# Altium schematic sheet Cell_Connections.SchDoc
size Letter
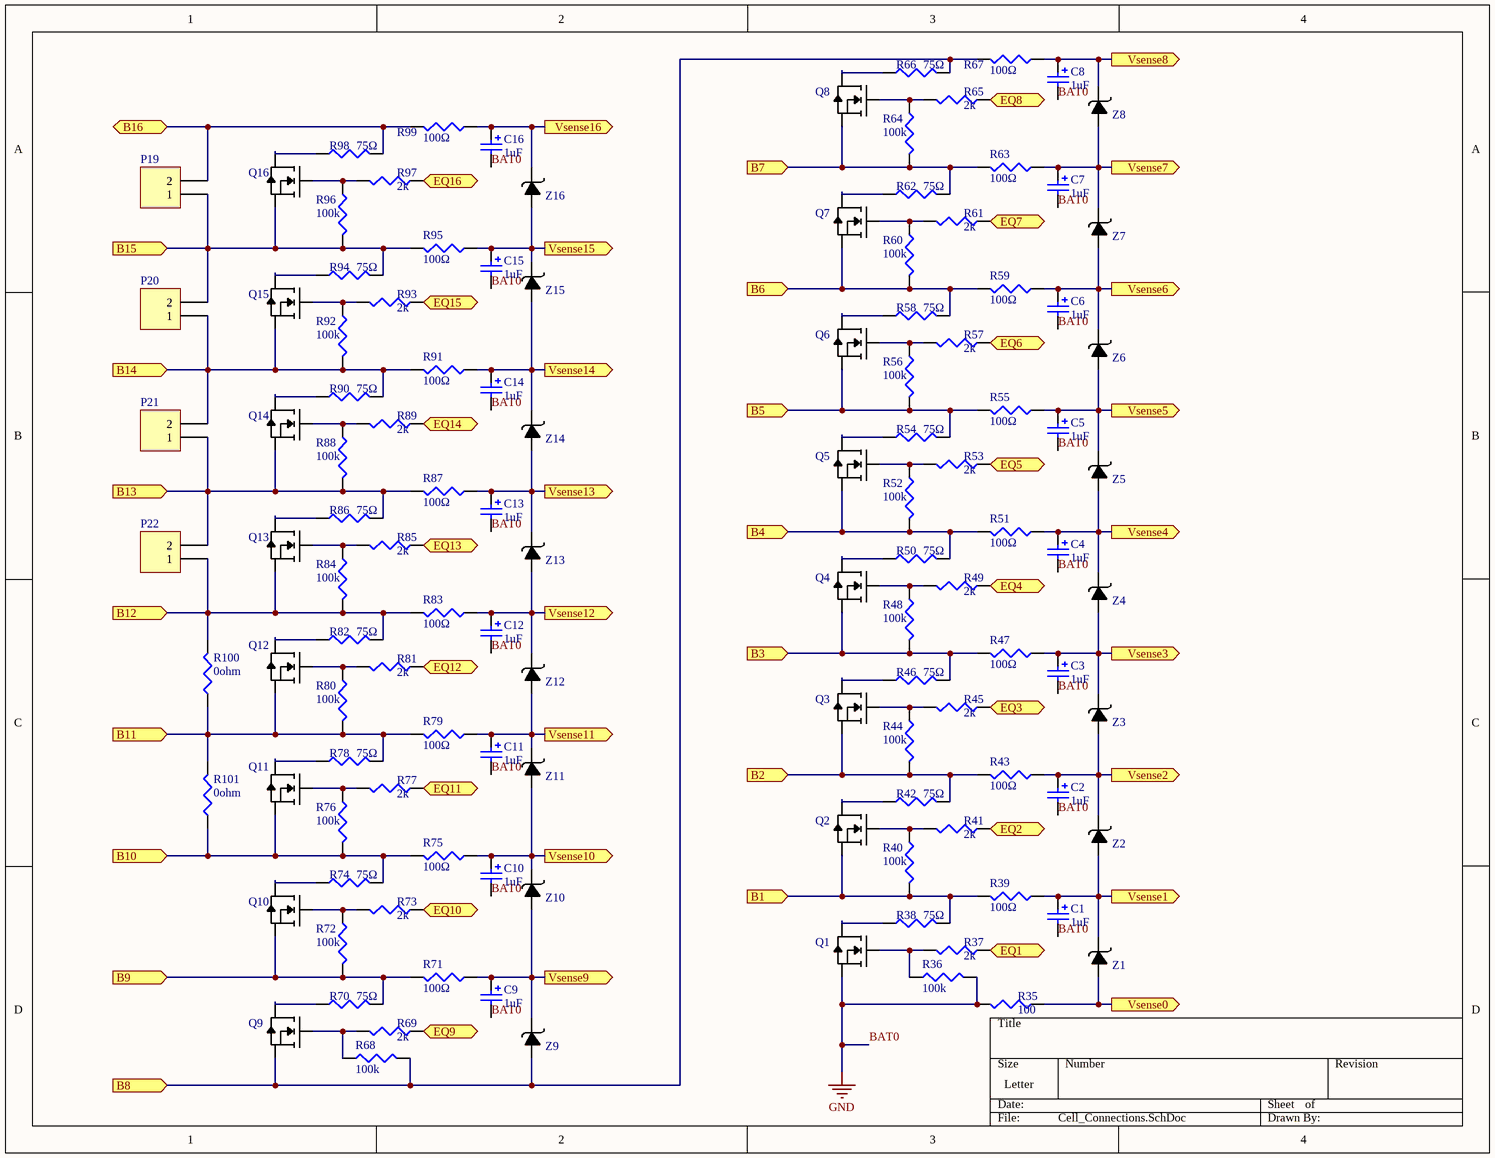
[diagram p0: Cell_Connections.SchDoc]

## Parts
C1  value 1uF  [SMD1206 Polarized]  (hidden comment: Cap)
C2  value 1uF  [SMD1206 Polarized]  (hidden comment: Cap)
C3  value 1uF  [SMD1206 Polarized]  (hidden comment: Cap)
C4  value 1uF  [SMD1206 Polarized]  (hidden comment: Cap)
C5  value 1uF  [SMD1206 Polarized]  (hidden comment: Cap)
C6  value 1uF  [SMD1206 Polarized]  (hidden comment: Cap)
C7  value 1uF  [SMD1206 Polarized]  (hidden comment: Cap)
C8  value 1uF  [SMD1206 Polarized]  (hidden comment: Cap)
C9  value 1uF  [SMD1206 Polarized]  (hidden comment: Cap)
C10  value 1uF  [SMD1206 Polarized]  (hidden comment: Cap)
C11  value 1uF  [SMD1206 Polarized]  (hidden comment: Cap)
C12  value 1uF  [SMD1206 Polarized]  (hidden comment: Cap)
C13  value 1uF  [SMD1206 Polarized]  (hidden comment: Cap)
C14  value 1uF  [SMD1206 Polarized]  (hidden comment: Cap)
C15  value 1uF  [SMD1206 Polarized]  (hidden comment: Cap)
C16  value 1uF  [SMD1206 Polarized]  (hidden comment: Cap)
P19  Header  [Header 2x1]  (value not drawn)
P20  Header  [Header 2x1]  (value not drawn)
P21  Header  [Header 2x1]  (value not drawn)
P22  Header  [Header 2x1]  (value not drawn)
Q1  Transistor  [Transistor 3-Lead]  (value not drawn)
Q2  Transistor  [Transistor 3-Lead]  (value not drawn)
Q3  Transistor  [Transistor 3-Lead]  (value not drawn)
Q4  Transistor  [Transistor 3-Lead]  (value not drawn)
Q5  Transistor  [Transistor 3-Lead]  (value not drawn)
Q6  Transistor  [Transistor 3-Lead]  (value not drawn)
Q7  Transistor  [Transistor 3-Lead]  (value not drawn)
Q8  Transistor  [Transistor 3-Lead]  (value not drawn)
Q9  Transistor  [Transistor 3-Lead]  (value not drawn)
Q10  Transistor  [Transistor 3-Lead]  (value not drawn)
Q11  Transistor  [Transistor 3-Lead]  (value not drawn)
Q12  Transistor  [Transistor 3-Lead]  (value not drawn)
Q13  Transistor  [Transistor 3-Lead]  (value not drawn)
Q14  Transistor  [Transistor 3-Lead]  (value not drawn)
Q15  Transistor  [Transistor 3-Lead]  (value not drawn)
Q16  Transistor  [Transistor 3-Lead]  (value not drawn)
R35  value 100  [SMD0603]  (hidden comment: Res)
R36  value 100k  [SMD0603]  (hidden comment: Res)
R37  value 2k  [SMD0603]  (hidden comment: Res)
R38  value 75Ω  [SMD0603]  (hidden comment: Res)
R39  value 100Ω  [SMD0603]  (hidden comment: Res)
R40  value 100k  [SMD0603]  (hidden comment: Res)
R41  value 2k  [SMD0603]  (hidden comment: Res)
R42  value 75Ω  [SMD0603]  (hidden comment: Res)
R43  value 100Ω  [SMD0603]  (hidden comment: Res)
R44  value 100k  [SMD0603]  (hidden comment: Res)
R45  value 2k  [SMD0603]  (hidden comment: Res)
R46  value 75Ω  [SMD0603]  (hidden comment: Res)
R47  value 100Ω  [SMD0603]  (hidden comment: Res)
R48  value 100k  [SMD0603]  (hidden comment: Res)
R49  value 2k  [SMD0603]  (hidden comment: Res)
R50  value 75Ω  [SMD0603]  (hidden comment: Res)
R51  value 100Ω  [SMD0603]  (hidden comment: Res)
R52  value 100k  [SMD0603]  (hidden comment: Res)
R53  value 2k  [SMD0603]  (hidden comment: Res)
R54  value 75Ω  [SMD0603]  (hidden comment: Res)
R55  value 100Ω  [SMD0603]  (hidden comment: Res)
R56  value 100k  [SMD0603]  (hidden comment: Res)
R57  value 2k  [SMD0603]  (hidden comment: Res)
R58  value 75Ω  [SMD0603]  (hidden comment: Res)
R59  value 100Ω  [SMD0603]  (hidden comment: Res)
R60  value 100k  [SMD0603]  (hidden comment: Res)
R61  value 2k  [SMD0603]  (hidden comment: Res)
R62  value 75Ω  [SMD0603]  (hidden comment: Res)
R63  value 100Ω  [SMD0603]  (hidden comment: Res)
R64  value 100k  [SMD0603]  (hidden comment: Res)
R65  value 2k  [SMD0603]  (hidden comment: Res)
R66  value 75Ω  [SMD0603]  (hidden comment: Res)
R67  value 100Ω  [SMD0603]  (hidden comment: Res)
R68  value 100k  [SMD0603]  (hidden comment: Res)
R69  value 2k  [SMD0603]  (hidden comment: Res)
R70  value 75Ω  [SMD0603]  (hidden comment: Res)
R71  value 100Ω  [SMD0603]  (hidden comment: Res)
R72  value 100k  [SMD0603]  (hidden comment: Res)
R73  value 2k  [SMD0603]  (hidden comment: Res)
R74  value 75Ω  [SMD0603]  (hidden comment: Res)
R75  value 100Ω  [SMD0603]  (hidden comment: Res)
R76  value 100k  [SMD0603]  (hidden comment: Res)
R77  value 2k  [SMD0603]  (hidden comment: Res)
R78  value 75Ω  [SMD0603]  (hidden comment: Res)
R79  value 100Ω  [SMD0603]  (hidden comment: Res)
R80  value 100k  [SMD0603]  (hidden comment: Res)
R81  value 2k  [SMD0603]  (hidden comment: Res)
R82  value 75Ω  [SMD0603]  (hidden comment: Res)
R83  value 100Ω  [SMD0603]  (hidden comment: Res)
R84  value 100k  [SMD0603]  (hidden comment: Res)
R85  value 2k  [SMD0603]  (hidden comment: Res)
R86  value 75Ω  [SMD0603]  (hidden comment: Res)
R87  value 100Ω  [SMD0603]  (hidden comment: Res)
R88  value 100k  [SMD0603]  (hidden comment: Res)
R89  value 2k  [SMD0603]  (hidden comment: Res)
R90  value 75Ω  [SMD0603]  (hidden comment: Res)
R91  value 100Ω  [SMD0603]  (hidden comment: Res)
R92  value 100k  [SMD0603]  (hidden comment: Res)
R93  value 2k  [SMD0603]  (hidden comment: Res)
R94  value 75Ω  [SMD0603]  (hidden comment: Res)
R95  value 100Ω  [SMD0603]  (hidden comment: Res)
R96  value 100k  [SMD0603]  (hidden comment: Res)
R97  value 2k  [SMD0603]  (hidden comment: Res)
R98  value 75Ω  [SMD0603]  (hidden comment: Res)
R99  value 100Ω  [SMD0603]  (hidden comment: Res)
R100  value 0ohm  [SMD0603]  (hidden comment: Res)
R101  value 0ohm  [SMD0603]  (hidden comment: Res)
Z1  Zener Diode  [ZenerCell]  (value not drawn)
Z2  Zener Diode  [ZenerCell]  (value not drawn)
Z3  Zener Diode  [ZenerCell]  (value not drawn)
Z4  Zener Diode  [ZenerCell]  (value not drawn)
Z5  Zener Diode  [ZenerCell]  (value not drawn)
Z6  Zener Diode  [ZenerCell]  (value not drawn)
Z7  Zener Diode  [ZenerCell]  (value not drawn)
Z8  Zener Diode  [ZenerCell]  (value not drawn)
Z9  Zener Diode  [ZenerCell]  (value not drawn)
Z10  Zener Diode  [ZenerCell]  (value not drawn)
Z11  Zener Diode  [ZenerCell]  (value not drawn)
Z12  Zener Diode  [ZenerCell]  (value not drawn)
Z13  Zener Diode  [ZenerCell]  (value not drawn)
Z14  Zener Diode  [ZenerCell]  (value not drawn)
Z15  Zener Diode  [ZenerCell]  (value not drawn)
Z16  Zener Diode  [ZenerCell]  (value not drawn)

## Ports
B1 (in), B2 (in), B3 (in), B4 (in), B5 (in), B6 (in), B7 (in), B8 (in), B9 (in), B10 (in), B11 (in), B12 (in), B13 (in), B14 (in), B15 (in), B16 (bidir), EQ1 (in), EQ2 (in), EQ3 (in), EQ4 (in), EQ5 (in), EQ6 (in), EQ7 (in), EQ8 (in), EQ9 (in), EQ10 (in), EQ11 (in), EQ12 (in), EQ13 (in), EQ14 (in), EQ15 (in), EQ16 (in), Vsense0 (out), Vsense1 (out), Vsense2 (out), Vsense3 (out), Vsense4 (out), Vsense5 (out), Vsense6 (out), Vsense7 (out), Vsense8 (out), Vsense9 (out), Vsense10 (out), Vsense11 (out), Vsense12 (out), Vsense13 (out), Vsense14 (out), Vsense15 (out), Vsense16 (out)

## Nets
BAT0: C1.2 C2.2 C3.2 C4.2 C5.2 C6.2 C7.2 C8.2 C9.2 C10.2 C11.2 C12.2 C13.2 C14.2 C15.2 C16.2 Q1.3(S) R35.2 R36.2  [also labelled GND]
B1: Q2.3(S) R38.2 R39.2 R40.2 ; port B1
B2: Q3.3(S) R42.2 R43.2 R44.2 ; port B2
B3: Q4.3(S) R46.2 R47.2 R48.2 ; port B3
B4: Q5.3(S) R50.2 R51.2 R52.2 ; port B4
B5: Q6.3(S) R54.2 R55.2 R56.2 ; port B5
B6: Q7.3(S) R58.2 R59.2 R60.2 ; port B6
B7: Q8.3(S) R62.2 R63.2 R64.2 ; port B7
B8: Q9.3(S) R66.2 R67.2 R68.2 Z9.1 ; port B8
B9: Q10.3(S) R70.2 R71.2 R72.2 ; port B9
B10: Q11.3(S) R74.2 R75.2 R76.2 R101.1 ; port B10
B11: Q12.3(S) R78.2 R79.2 R80.2 R100.1 R101.2 ; port B11
B12: P22.1 Q13.3(S) R82.2 R83.2 R84.2 R100.2 ; port B12
B13: P21.1 P22.2 Q14.3(S) R86.2 R87.2 R88.2 ; port B13
B14: P20.1 P21.2 Q15.3(S) R90.2 R91.2 R92.2 ; port B14
B15: P19.1 P20.2 Q16.3(S) R94.2 R95.2 R96.2 ; port B15
B16: P19.2 R98.2 R99.2 ; port B16
EQ1: R37.1 ; port EQ1
EQ2: R41.1 ; port EQ2
EQ3: R45.1 ; port EQ3
EQ4: R49.1 ; port EQ4
EQ5: R53.1 ; port EQ5
EQ6: R57.1 ; port EQ6
EQ7: R61.1 ; port EQ7
EQ8: R65.1 ; port EQ8
EQ9: R69.1 ; port EQ9
EQ10: R73.1 ; port EQ10
EQ11: R77.1 ; port EQ11
EQ12: R81.1 ; port EQ12
EQ13: R85.1 ; port EQ13
EQ14: R89.1 ; port EQ14
EQ15: R93.1 ; port EQ15
EQ16: R97.1 ; port EQ16
Vsense0: R35.1 Z1.1 ; port Vsense0
Vsense1: C1.1 R39.1 Z1.2 Z2.1 ; port Vsense1
Vsense2: C2.1 R43.1 Z2.2 Z3.1 ; port Vsense2
Vsense3: C3.1 R47.1 Z3.2 Z4.1 ; port Vsense3
Vsense4: C4.1 R51.1 Z4.2 Z5.1 ; port Vsense4
Vsense5: C5.1 R55.1 Z5.2 Z6.1 ; port Vsense5
Vsense6: C6.1 R59.1 Z6.2 Z7.1 ; port Vsense6
Vsense7: C7.1 R63.1 Z7.2 Z8.1 ; port Vsense7
Vsense8: C8.1 R67.1 Z8.2 ; port Vsense8
Vsense9: C9.1 R71.1 Z9.2 Z10.1 ; port Vsense9
Vsense10: C10.1 R75.1 Z10.2 Z11.1 ; port Vsense10
Vsense11: C11.1 R79.1 Z11.2 Z12.1 ; port Vsense11
Vsense12: C12.1 R83.1 Z12.2 Z13.1 ; port Vsense12
Vsense13: C13.1 R87.1 Z13.2 Z14.1 ; port Vsense13
Vsense14: C14.1 R91.1 Z14.2 Z15.1 ; port Vsense14
Vsense15: C15.1 R95.1 Z15.2 Z16.1 ; port Vsense15
Vsense16: C16.1 R99.1 Z16.2 ; port Vsense16
NetQ1_1: Q1.1(D) R38.1
NetQ1_2: Q1.2(G) R36.1 R37.2
NetQ2_1: Q2.1(D) R42.1
NetQ2_2: Q2.2(G) R40.1 R41.2
NetQ3_1: Q3.1(D) R46.1
NetQ3_2: Q3.2(G) R44.1 R45.2
NetQ4_1: Q4.1(D) R50.1
NetQ4_2: Q4.2(G) R48.1 R49.2
NetQ5_1: Q5.1(D) R54.1
NetQ5_2: Q5.2(G) R52.1 R53.2
NetQ6_1: Q6.1(D) R58.1
NetQ6_2: Q6.2(G) R56.1 R57.2
NetQ7_1: Q7.1(D) R62.1
NetQ7_2: Q7.2(G) R60.1 R61.2
NetQ8_1: Q8.1(D) R66.1
NetQ8_2: Q8.2(G) R64.1 R65.2
NetQ9_1: Q9.1(D) R70.1
NetQ9_2: Q9.2(G) R68.1 R69.2
NetQ10_1: Q10.1(D) R74.1
NetQ10_2: Q10.2(G) R72.1 R73.2
NetQ11_1: Q11.1(D) R78.1
NetQ11_2: Q11.2(G) R76.1 R77.2
NetQ12_1: Q12.1(D) R82.1
NetQ12_2: Q12.2(G) R80.1 R81.2
NetQ13_1: Q13.1(D) R86.1
NetQ13_2: Q13.2(G) R84.1 R85.2
NetQ14_1: Q14.1(D) R90.1
NetQ14_2: Q14.2(G) R88.1 R89.2
NetQ15_1: Q15.1(D) R94.1
NetQ15_2: Q15.2(G) R92.1 R93.2
NetQ16_1: Q16.1(D) R98.1
NetQ16_2: Q16.2(G) R96.1 R97.2

## Library data of the parts
C1-C16 = Capacitor Polarized: Polarized Capacitor (Surface Mount)
P19-P22 = Header 2x1: Header, 2-Pin
R35-R101 = Resistor